# EasyEDA Pro project ProPrj_LogicCard.epro, board PCB1
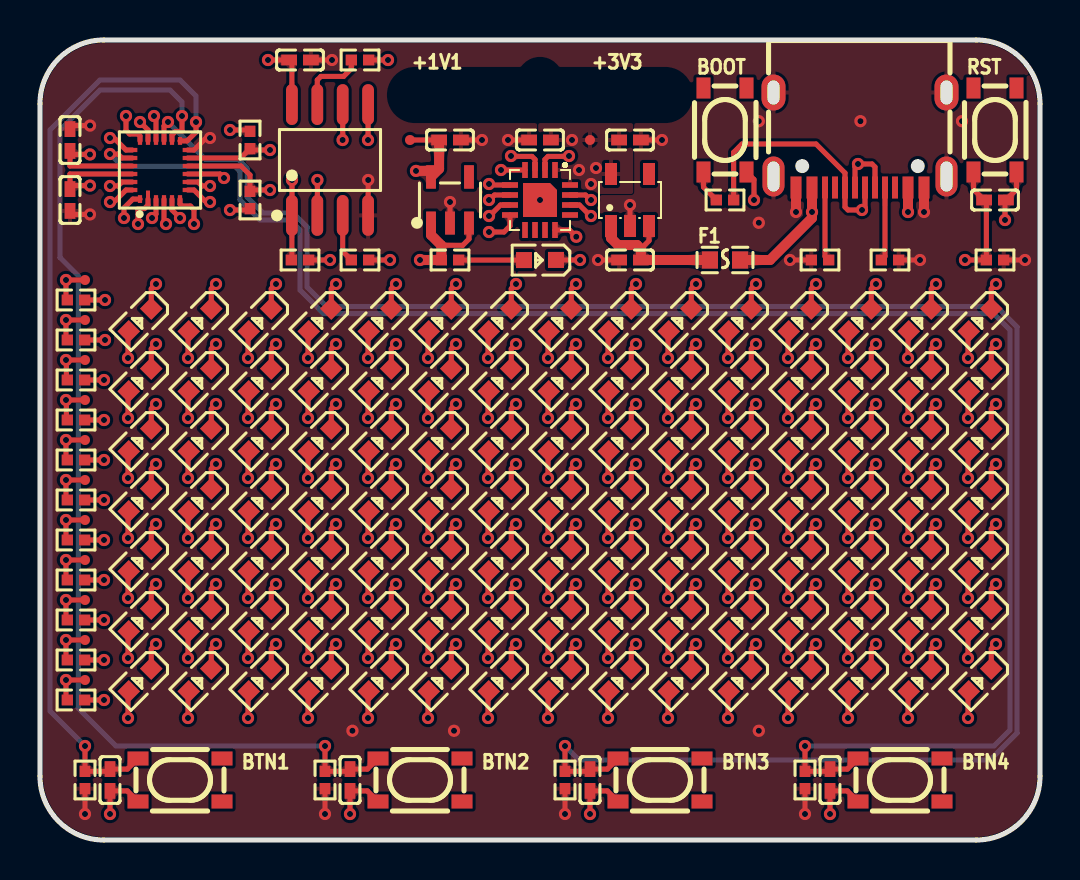
[diagram p1: board, top side]
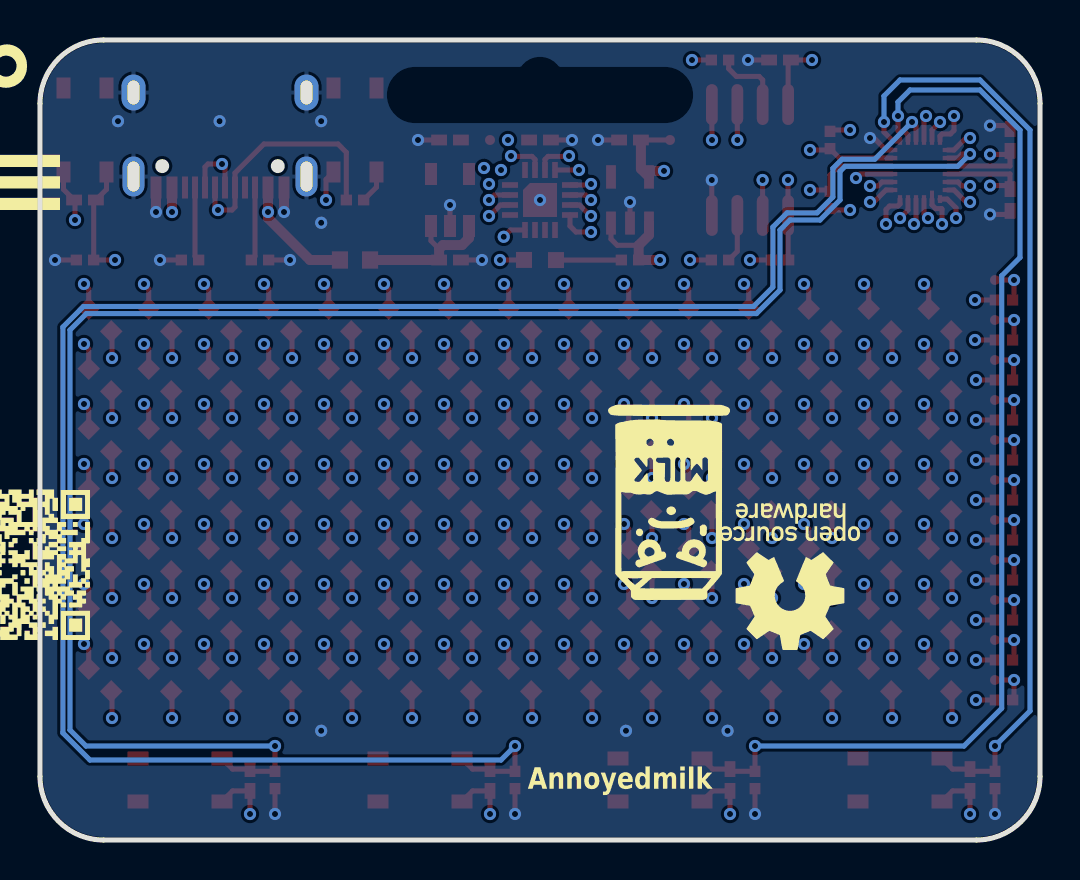
[diagram p2: board, bottom side, seen from below]

Outline 50 x 40 mm; copper layers: Top Layer, Inner1, Inner2, Bottom Layer. Coordinates in mm from the lower left corner of the outline.
Outline path: 0,36.82 0,3.18 arc(0.93,0.93) 3.18,0 46.82,0 arc(49.07,0.93) 50,3.18 50,36.82 arc(49.07,39.07) 46.82,40 3.18,40 arc(0.93,39.07) 0,36.82
Stack: Top Layer 0.035mm Outer layer thickness 1oz / Dielectric1 0.2104mm 7628 RC49% 8.6mil / Inner1 0.0152mm Inner layer thickness / Dielectric2 1.065mm 1.1mm H/HOZ Copper / Inner2 0.0152mm Inner layer thickness / Dielectric3 0.2104mm 7628 RC49% 8.6mil / Bottom Layer 0.035mm Outer layer thickness 1oz

## Design rules (mm)
template: Custom Config
spacing copperThickness1oz (default): track to track 0.102, other pairs 0.152 to 0.3
spacing copperThickness2oz: track to track 0.203, other pairs 0.152 to 0.3
track width copperThickness1oz (default): min 0.127, default 0.254, max 2.54
track width copperThickness2oz: min 0.203, default 0.254, max 2.54
differential pair differentialPair (default): width min 0.127, default 0.254, max 2.54; gap min 0.152, default 0.152
via viaSize (default): diameter min 0.5, default 0.61, max 10; hole min 0.3, default 0.305, max 6.3

## Placement (name value [footprint] x y rotation side)
+1V1  -  [Test-Point-0.5mm]  18.5 35 0 top
+3V3  -  [Test-Point-0.5mm]  27.5 35 0 top
BOOT  SKRPACE010  [KEY-SMD_4P-L4.2-W3.2-P2.20-LS4.6]  34.25 35.5 90 top
BTN1  SKRPACE010  [KEY-SMD_4P-L4.2-W3.2-P2.20-LS4.6]  7 3 0 top
BTN2  SKRPACE010  [KEY-SMD_4P-L4.2-W3.2-P2.20-LS4.6]  19 3 0 top
BTN3  SKRPACE010  [KEY-SMD_4P-L4.2-W3.2-P2.20-LS4.6]  31 3 0 top
BTN4  SKRPACE010  [KEY-SMD_4P-L4.2-W3.2-P2.20-LS4.6]  43 3 0 top
C1  TYPE-C 16PIN 2MD(073)  [USB-C-SMD_TYPE-C-6PIN-2MD-073]  41 35 180 top
C5  1uF  [C0402]  25 35 0 top
C6  1uF  [C0402]  47.75 32 0 top
C8  1uF  [C0402]  29.5 35 180 top
C9  1uF  [C0402]  3.5 3 270 top
C10  1uF  [C0402]  15.5 3 270 top
C11  1uF  [C0402]  27.5 3 270 top
C12  1uF  [C0402]  39.5 3 270 top
C14  1uF  [C0402]  20.5 35 180 top
C15  1uF  [C0402]  1.5 32 270 top
C16  1uF  [C0402]  1.5 35 90 top
C17  1uF  [C0402]  29.5 29 0 top
C18  1uF  [C0402]  13 39 0 top
F1  MF-FSMF035X-2  [F0603]  34.25 29 180 top
LED1  19-213/Y2C-CQ2R2L/3T(CY)  [LED0603-RD-YELLOW]  5 26 225 top
LED2  19-213/Y2C-CQ2R2L/3T(CY)  [LED0603-RD-YELLOW]  8 26 225 top
LED3  19-213/Y2C-CQ2R2L/3T(CY)  [LED0603-RD-YELLOW]  11 26 225 top
LED4  19-213/Y2C-CQ2R2L/3T(CY)  [LED0603-RD-YELLOW]  14 26 225 top
LED5  19-213/Y2C-CQ2R2L/3T(CY)  [LED0603-RD-YELLOW]  17 26 225 top
LED6  19-213/Y2C-CQ2R2L/3T(CY)  [LED0603-RD-YELLOW]  20 26 225 top
LED7  19-213/Y2C-CQ2R2L/3T(CY)  [LED0603-RD-YELLOW]  23 26 225 top
LED8  19-213/Y2C-CQ2R2L/3T(CY)  [LED0603-RD-YELLOW]  26 26 225 top
LED9  19-213/Y2C-CQ2R2L/3T(CY)  [LED0603-RD-YELLOW]  29 26 225 top
LED10  19-213/Y2C-CQ2R2L/3T(CY)  [LED0603-RD-YELLOW]  32 26 225 top
LED11  19-213/Y2C-CQ2R2L/3T(CY)  [LED0603-RD-YELLOW]  35 26 225 top
LED12  19-213/Y2C-CQ2R2L/3T(CY)  [LED0603-RD-YELLOW]  38 26 225 top
LED13  19-213/Y2C-CQ2R2L/3T(CY)  [LED0603-RD-YELLOW]  41 26 225 top
LED14  19-213/Y2C-CQ2R2L/3T(CY)  [LED0603-RD-YELLOW]  44 26 225 top
LED15  19-213/Y2C-CQ2R2L/3T(CY)  [LED0603-RD-YELLOW]  47 26 225 top
LED16  19-213/Y2C-CQ2R2L/3T(CY)  [LED0603-RD-YELLOW]  5 23 225 top
LED17  19-213/Y2C-CQ2R2L/3T(CY)  [LED0603-RD-YELLOW]  8 23 225 top
LED18  19-213/Y2C-CQ2R2L/3T(CY)  [LED0603-RD-YELLOW]  11 23 225 top
LED19  19-213/Y2C-CQ2R2L/3T(CY)  [LED0603-RD-YELLOW]  14 23 225 top
LED20  19-213/Y2C-CQ2R2L/3T(CY)  [LED0603-RD-YELLOW]  17 23 225 top
LED21  19-213/Y2C-CQ2R2L/3T(CY)  [LED0603-RD-YELLOW]  20 23 225 top
LED22  19-213/Y2C-CQ2R2L/3T(CY)  [LED0603-RD-YELLOW]  23 23 225 top
LED23  19-213/Y2C-CQ2R2L/3T(CY)  [LED0603-RD-YELLOW]  26 23 225 top
LED24  19-213/Y2C-CQ2R2L/3T(CY)  [LED0603-RD-YELLOW]  29 23 225 top
LED25  19-213/Y2C-CQ2R2L/3T(CY)  [LED0603-RD-YELLOW]  32 23 225 top
LED26  19-213/Y2C-CQ2R2L/3T(CY)  [LED0603-RD-YELLOW]  35 23 225 top
LED27  19-213/Y2C-CQ2R2L/3T(CY)  [LED0603-RD-YELLOW]  38 23 225 top
LED28  19-213/Y2C-CQ2R2L/3T(CY)  [LED0603-RD-YELLOW]  41 23 225 top
LED29  19-213/Y2C-CQ2R2L/3T(CY)  [LED0603-RD-YELLOW]  44 23 225 top
LED30  19-213/Y2C-CQ2R2L/3T(CY)  [LED0603-RD-YELLOW]  47 23 225 top
LED31  19-213/Y2C-CQ2R2L/3T(CY)  [LED0603-RD-YELLOW]  5 20 225 top
LED32  19-213/Y2C-CQ2R2L/3T(CY)  [LED0603-RD-YELLOW]  8 20 225 top
LED33  19-213/Y2C-CQ2R2L/3T(CY)  [LED0603-RD-YELLOW]  11 20 225 top
LED34  19-213/Y2C-CQ2R2L/3T(CY)  [LED0603-RD-YELLOW]  14 20 225 top
LED35  19-213/Y2C-CQ2R2L/3T(CY)  [LED0603-RD-YELLOW]  17 20 225 top
LED36  19-213/Y2C-CQ2R2L/3T(CY)  [LED0603-RD-YELLOW]  20 20 225 top
LED37  19-213/Y2C-CQ2R2L/3T(CY)  [LED0603-RD-YELLOW]  23 20 225 top
LED38  19-213/Y2C-CQ2R2L/3T(CY)  [LED0603-RD-YELLOW]  26 20 225 top
LED39  19-213/Y2C-CQ2R2L/3T(CY)  [LED0603-RD-YELLOW]  29 20 225 top
LED40  19-213/Y2C-CQ2R2L/3T(CY)  [LED0603-RD-YELLOW]  32 20 225 top
LED41  19-213/Y2C-CQ2R2L/3T(CY)  [LED0603-RD-YELLOW]  35 20 225 top
LED42  19-213/Y2C-CQ2R2L/3T(CY)  [LED0603-RD-YELLOW]  38 20 225 top
LED43  19-213/Y2C-CQ2R2L/3T(CY)  [LED0603-RD-YELLOW]  41 20 225 top
LED44  19-213/Y2C-CQ2R2L/3T(CY)  [LED0603-RD-YELLOW]  44 20 225 top
LED45  19-213/Y2C-CQ2R2L/3T(CY)  [LED0603-RD-YELLOW]  47 20 225 top
LED46  19-213/Y2C-CQ2R2L/3T(CY)  [LED0603-RD-YELLOW]  5 17 225 top
LED47  19-213/Y2C-CQ2R2L/3T(CY)  [LED0603-RD-YELLOW]  8 17 225 top
LED48  19-213/Y2C-CQ2R2L/3T(CY)  [LED0603-RD-YELLOW]  11 17 225 top
LED49  19-213/Y2C-CQ2R2L/3T(CY)  [LED0603-RD-YELLOW]  14 17 225 top
LED50  19-213/Y2C-CQ2R2L/3T(CY)  [LED0603-RD-YELLOW]  17 17 225 top
LED51  19-213/Y2C-CQ2R2L/3T(CY)  [LED0603-RD-YELLOW]  20 17 225 top
LED52  19-213/Y2C-CQ2R2L/3T(CY)  [LED0603-RD-YELLOW]  23 17 225 top
LED53  19-213/Y2C-CQ2R2L/3T(CY)  [LED0603-RD-YELLOW]  26 17 225 top
LED54  19-213/Y2C-CQ2R2L/3T(CY)  [LED0603-RD-YELLOW]  29 17 225 top
LED55  19-213/Y2C-CQ2R2L/3T(CY)  [LED0603-RD-YELLOW]  32 17 225 top
LED56  19-213/Y2C-CQ2R2L/3T(CY)  [LED0603-RD-YELLOW]  35 17 225 top
LED57  19-213/Y2C-CQ2R2L/3T(CY)  [LED0603-RD-YELLOW]  38 17 225 top
LED58  19-213/Y2C-CQ2R2L/3T(CY)  [LED0603-RD-YELLOW]  41 17 225 top
LED59  19-213/Y2C-CQ2R2L/3T(CY)  [LED0603-RD-YELLOW]  44 17 225 top
LED60  19-213/Y2C-CQ2R2L/3T(CY)  [LED0603-RD-YELLOW]  47 17 225 top
LED61  19-213/Y2C-CQ2R2L/3T(CY)  [LED0603-RD-YELLOW]  5 14 225 top
LED62  19-213/Y2C-CQ2R2L/3T(CY)  [LED0603-RD-YELLOW]  8 14 225 top
LED63  19-213/Y2C-CQ2R2L/3T(CY)  [LED0603-RD-YELLOW]  11 14 225 top
LED64  19-213/Y2C-CQ2R2L/3T(CY)  [LED0603-RD-YELLOW]  14 14 225 top
LED65  19-213/Y2C-CQ2R2L/3T(CY)  [LED0603-RD-YELLOW]  17 14 225 top
LED66  19-213/Y2C-CQ2R2L/3T(CY)  [LED0603-RD-YELLOW]  20 14 225 top
LED67  19-213/Y2C-CQ2R2L/3T(CY)  [LED0603-RD-YELLOW]  23 14 225 top
LED68  19-213/Y2C-CQ2R2L/3T(CY)  [LED0603-RD-YELLOW]  26 14 225 top
LED69  19-213/Y2C-CQ2R2L/3T(CY)  [LED0603-RD-YELLOW]  29 14 225 top
LED70  19-213/Y2C-CQ2R2L/3T(CY)  [LED0603-RD-YELLOW]  32 14 225 top
LED71  19-213/Y2C-CQ2R2L/3T(CY)  [LED0603-RD-YELLOW]  35 14 225 top
LED72  19-213/Y2C-CQ2R2L/3T(CY)  [LED0603-RD-YELLOW]  38 14 225 top
LED73  19-213/Y2C-CQ2R2L/3T(CY)  [LED0603-RD-YELLOW]  41 14 225 top
LED74  19-213/Y2C-CQ2R2L/3T(CY)  [LED0603-RD-YELLOW]  44 14 225 top
LED75  19-213/Y2C-CQ2R2L/3T(CY)  [LED0603-RD-YELLOW]  47 14 225 top
LED76  19-213/Y2C-CQ2R2L/3T(CY)  [LED0603-RD-YELLOW]  5 11 225 top
LED77  19-213/Y2C-CQ2R2L/3T(CY)  [LED0603-RD-YELLOW]  8 11 225 top
LED78  19-213/Y2C-CQ2R2L/3T(CY)  [LED0603-RD-YELLOW]  11 11 225 top
LED79  19-213/Y2C-CQ2R2L/3T(CY)  [LED0603-RD-YELLOW]  14 11 225 top
LED80  19-213/Y2C-CQ2R2L/3T(CY)  [LED0603-RD-YELLOW]  17 11 225 top
LED81  19-213/Y2C-CQ2R2L/3T(CY)  [LED0603-RD-YELLOW]  20 11 225 top
LED82  19-213/Y2C-CQ2R2L/3T(CY)  [LED0603-RD-YELLOW]  23 11 225 top
LED83  19-213/Y2C-CQ2R2L/3T(CY)  [LED0603-RD-YELLOW]  26 11 225 top
LED84  19-213/Y2C-CQ2R2L/3T(CY)  [LED0603-RD-YELLOW]  29 11 225 top
LED85  19-213/Y2C-CQ2R2L/3T(CY)  [LED0603-RD-YELLOW]  32 11 225 top
LED86  19-213/Y2C-CQ2R2L/3T(CY)  [LED0603-RD-YELLOW]  35 11 225 top
LED87  19-213/Y2C-CQ2R2L/3T(CY)  [LED0603-RD-YELLOW]  38 11 225 top
LED88  19-213/Y2C-CQ2R2L/3T(CY)  [LED0603-RD-YELLOW]  41 11 225 top
LED89  19-213/Y2C-CQ2R2L/3T(CY)  [LED0603-RD-YELLOW]  44 11 225 top
LED90  19-213/Y2C-CQ2R2L/3T(CY)  [LED0603-RD-YELLOW]  47 11 225 top
LED91  19-213/Y2C-CQ2R2L/3T(CY)  [LED0603-RD-YELLOW]  5 8 225 top
LED92  19-213/Y2C-CQ2R2L/3T(CY)  [LED0603-RD-YELLOW]  8 8 225 top
LED93  19-213/Y2C-CQ2R2L/3T(CY)  [LED0603-RD-YELLOW]  11 8 225 top
LED94  19-213/Y2C-CQ2R2L/3T(CY)  [LED0603-RD-YELLOW]  14 8 225 top
LED95  19-213/Y2C-CQ2R2L/3T(CY)  [LED0603-RD-YELLOW]  17 8 225 top
LED96  19-213/Y2C-CQ2R2L/3T(CY)  [LED0603-RD-YELLOW]  20 8 225 top
LED97  19-213/Y2C-CQ2R2L/3T(CY)  [LED0603-RD-YELLOW]  23 8 225 top
LED98  19-213/Y2C-CQ2R2L/3T(CY)  [LED0603-RD-YELLOW]  26 8 225 top
LED99  19-213/Y2C-CQ2R2L/3T(CY)  [LED0603-RD-YELLOW]  29 8 225 top
LED100  19-213/Y2C-CQ2R2L/3T(CY)  [LED0603-RD-YELLOW]  32 8 225 top
LED101  19-213/Y2C-CQ2R2L/3T(CY)  [LED0603-RD-YELLOW]  35 8 225 top
LED102  19-213/Y2C-CQ2R2L/3T(CY)  [LED0603-RD-YELLOW]  38 8 225 top
LED103  19-213/Y2C-CQ2R2L/3T(CY)  [LED0603-RD-YELLOW]  41 8 225 top
LED104  19-213/Y2C-CQ2R2L/3T(CY)  [LED0603-RD-YELLOW]  44 8 225 top
LED105  19-213/Y2C-CQ2R2L/3T(CY)  [LED0603-RD-YELLOW]  47 8 225 top
LED106  19-213/Y2C-CQ2R2L/3T(CY)  [LED0603-RD-YELLOW]  25 29 180 top
R18  5.1kΩ  [R0402]  39 29 180 top
R19  5.1kΩ  [R0402]  42.5 29 0 top
R23  10kΩ  [R0402]  47.75 29 0 top
R24  10kΩ  [R0402]  34.25 32 0 top
R36  10kΩ  [R0402]  2.25 3 270 top
R37  10kΩ  [R0402]  14.25 3 270 top
R38  10kΩ  [R0402]  26.25 3 270 top
R39  10kΩ  [R0402]  38.25 3 270 top
R41  82Ω  [R0402]  1.8 27 0 top
R42  82Ω  [R0402]  1.8 25 0 top
R43  82Ω  [R0402]  1.8 23 0 top
R44  82Ω  [R0402]  1.8 21 0 top
R45  82Ω  [R0402]  1.8 19 0 top
R46  82Ω  [R0402]  1.8 17 0 top
R47  82Ω  [R0402]  1.8 15 0 top
R48  82Ω  [R0402]  1.8 13 0 top
R49  82Ω  [R0402]  1.8 11 0 top
R50  82Ω  [R0402]  1.8 9 0 top
R51  82Ω  [R0402]  1.8 7 0 top
R52  180Ω  [R0402]  20.5 29 180 top
R53  10kΩ  [R0402]  10.5 32 90 top
R54  10kΩ  [R0402]  10.5 35 270 top
R55  10kΩ  [R0402]  13 29 180 top
R56  10kΩ  [R0402]  16 29 180 top
R57  10kΩ  [R0402]  16 39 180 top
RST  SKRPACE010  [KEY-SMD_4P-L4.2-W3.2-P2.20-LS4.6]  47.75 35.5 90 top
TP1  -  [Test-Point-0.5mm]  2.25 28 0 top
TP2  -  [Test-Point-0.5mm]  2.25 26 0 top
TP3  -  [Test-Point-0.5mm]  2.25 24 0 top
TP4  -  [Test-Point-0.5mm]  2.25 22 0 top
TP5  -  [Test-Point-0.5mm]  2.25 20 0 top
TP6  -  [Test-Point-0.5mm]  2.25 18 0 top
TP7  -  [Test-Point-0.5mm]  2.25 16 0 top
TP8  -  [Test-Point-0.5mm]  2.25 14 0 top
TP9  -  [Test-Point-0.5mm]  2.25 12 0 top
TP10  -  [Test-Point-0.5mm]  2.25 10 0 top
TP11  -  [Test-Point-0.5mm]  2.25 8 0 top
U1  SLG47910V  [STQFN-24_L3.0-W3.0-P0.4_SLG47910V]  6 33.5 90 top
U2  CH552P  [VQFN-16_L3.0-W3.0-P0.50-BL-EP1.7]  25 32 180 top
U3  W25Q80DVSNIG  [SOIC-8_L4.9-W3.9-P1.27-LS6.0-BL]  14.5 34 0 top
U4  TLV70233DBVR  [SOT-23-5_L3.0-W1.7-P0.95-LS2.8-BR]  29.5 32 270 top
U5  TLV74311PDBVR  [SOT-23-5_L3.0-W1.7-P0.95-LS2.8-BL]  20.5 32 0 top

## Footprints (pads in the part's own frame, mm; a bottom-side part is the same pattern mirrored in y, then rotated)
C0402
  rect 0.79x0.54 smd: 1(-0.545,0) 2(0.545,0)
F0603
  rect 0.806x0.864 smd: 1(-0.753,0) 2(0.753,0)
KEY-SMD_4P-L4.2-W3.2-P2.20-LS4.6
  rect 1.05x0.7 smd: 1(-2.1,1.075) 2(2.1,1.075) 3(-2.1,-1.075) 4(2.1,-1.075)
LED0603-RD-YELLOW
  rect 0.8x0.8 smd: 1(-0.799,-0.004) 2(0.799,0.004)
R0402
  rect 0.566x0.54 smd: 1(-0.433,0) 2(0.433,0)
SOIC-8_L4.9-W3.9-P1.27-LS6.0-BL
  oval 0.588x2.045 smd: 1(-1.905,-2.772) 2(-0.635,-2.772) 3(0.635,-2.772) 4(1.905,-2.772) 5(1.905,2.772) 6(0.635,2.772) 7(-0.635,2.772) 8(-1.905,2.772)
SOT-23-5_L3.0-W1.7-P0.95-LS2.8-BL
  rect 0.49x1.157 smd: 1(-0.95,-1.153) 2(0,-1.153) 3(0.95,-1.153)
  rect 0.49x1.175 smd: 4(0.95,1.153) 5(-0.95,1.153)
SOT-23-5_L3.0-W1.7-P0.95-LS2.8-BR
  rect 1.1x0.6 smd: 1(1.3,-0.95) 2(1.3,0) 3(1.3,0.95) 4(-1.3,0.95) 5(-1.3,-0.95)
STQFN-24_L3.0-W3.0-P0.4_SLG47910V
  rect 0.39x0.21 smd: 1(-1.455,1) 3(-1.455,0.2) 4(-1.455,-0.2) 5(-1.455,-0.6) 6(-1.455,-1) 13(1.455,-1) 14(1.455,-0.6) 15(1.455,-0.2) 16(1.455,0.2) 17(1.455,0.6) 18(1.455,1)
  rect 0.605x0.2 smd: 2(-1.33,0.6)
  rect 0.21x0.515 smd: 7(-1,-1.393) 8(-0.6,-1.393) 9(-0.2,-1.393) 10(0.2,-1.393) 11(0.6,-1.393) 12(1,-1.393) 19(1,1.393) 20(0.6,1.393) 21(0.2,1.393) 22(-0.2,1.393) 23(-0.6,1.393) 24(-1,1.393)
Test-Point-0.5mm
  round 0.5 smd: 1(0,0)
USB-C-SMD_TYPE-C-6PIN-2MD-073
  rect 0.55x1.1 smd: 1(-3.2,2.375) 2(-2.4,2.375) 11(2.4,2.375) 12(3.2,2.375)
  rect 0.3x1.1 smd: 3(-1.75,2.375) 4(-1.25,2.375) 5(-0.75,2.375) 6(-0.25,2.375) 7(0.25,2.375) 8(0.75,2.375) 9(1.25,2.375) 10(1.75,2.375)
  oval 1.1x2 hole 0.6x1.5: 13(-4.325,1.825) 14(4.325,1.825)
  oval 1.2x1.8 hole 0.6x1.2: 13(-4.325,-2.375) 14(4.325,-2.375)
VQFN-16_L3.0-W3.0-P0.50-BL-EP1.7
  rect 0.28x0.8 smd: 1(-0.749,-1.5) 2(-0.249,-1.5) 3(0.249,-1.5) 4(0.75,-1.5) 9(0.75,1.5) 10(0.249,1.5) 11(-0.249,1.5) 12(-0.749,1.5)
  rect 0.8x0.28 smd: 5(1.5,-0.749) 6(1.5,-0.249) 7(1.5,0.249) 8(1.5,0.75) 13(-1.5,0.75) 14(-1.5,0.249) 15(-1.5,-0.249) 16(-1.5,-0.749)
  custom 1.7x1.7 smd: 17(0,0)

## Nets
As in the schematic.

Pads without a net: BOOT 2 4; BTN1 2 4; BTN2 2 4; BTN3 2 4; BTN4 2 4; C1 3 9; RST 2 4; U2 9 10 11 13; U4 4; U5 4

## Via types
v1: diameter 0.61, hole 0.305, Top Layer to Bottom Layer, 325 vias

## Routing (per net, layer and track width the routed paths; a pad name or vN(x,y) marks a point on that pad's centre or on a via; arc(x,y) is an arc through that point)
+1V1: length 34.6
  Top Layer w0.254: 1.68,32.72 1.5,32.9 1.5,33.3 U1.22 ; 1.68,32.72 v1(2.5,32.72) ; 1.68,32.72 C15.1 ; C14.2 +1V1.1
  Top Layer w0.5: C14.2 19.96,33.56 U5.5 19.55,33.45 v1(18.8,33.45)
  Inner2 w0.5: v1(18.8,33.45) 18.8,33.93 14.79,37.94 1.94,37.94 1,37 1,34.22 v1(2.5,32.72)
+3V3: length 206.3
  Top Layer w0.254: v1(35.7,32) 35.7,33.03 BOOT.3 ; v1(9.5,35.5) 10.43,35.5 R54.1 ; v1(48.25,31) 48.25,31.95 C6.2 48.82,32.53 RST.3 ; v1(11.4,39) 12.57,39 12.59,38.97 U3.8 ; R53.1 10.43,31.5 v1(9.5,31.5) ; v1(39.5,1.3) C12.2 40.37,2.45 BTN4.3 ; v1(27.5,1.3) C11.2 28.37,2.45 BTN3.3 ; v1(17.5,29) R56.1 ; v1(14.5,29) R55.1 ; BTN1.3 4.37,2.45 C9.2 v1(3.5,1.3) ; BTN2.3 16.37,2.45 C10.2 v1(15.5,1.3) ; 1.68,34.28 1.5,34.1 1.5,33.7 U1.21 ; 1.68,34.28 v1(2.5,34.28) ; 1.68,34.28 C16.1 ; U5.3 21.45,30.05 21.13,29.73 20.07,29.73 ; v1(17.4,39) R57.1
  Top Layer w0.5: v1(19,29) R52.2 20.07,29.73 19.55,30.25 U5.1
  Inner1 w0.254: v1(35.7,32) 33.8,30.1 27.82,30.1 26.9,31.02 26.9,32.6 27.1,32.8 v1(27.55,32.8) ; v1(19,29) v1(17.5,29) v1(14.5,29) 12,29 v1(9.5,31.5)
  Inner2 w0.254: v1(27.8,33.6) 29.07,32.33 29.74,32.33 30.08,32 v1(35.7,32) 36.23,32 37.48,30.75 44.37,30.75 44.63,31 v1(48.25,31) 48.25,28.75 49,28 49,3.5 46.8,1.3 v1(39.5,1.3) 39.08,1.3 38.49,1.88 38.01,1.88 37.42,1.3 v1(27.5,1.3) 27.14,1.3 26.46,1.98 26.1,1.98 25.42,1.3 v1(15.5,1.3) 15.2,1.3 14.5,2 14,2 13.3,1.3 v1(3.5,1.3) ; v1(11.4,39) 13.77,39 14.36,38.42 14.84,38.42 15.43,39 v1(17.4,39) 17.4,38.1 17,37.7 17,36.5 17.92,35.58 19.5,35.58 ; 10.92,35.5 v1(9.5,35.5) 8,37 2.95,37 1.82,35.87 1.82,34.96 v1(2.5,34.28) ; 10.92,35.5 13.8,35.5 14.89,34.42 17.01,34.42 18.56,32.87 19.04,32.87 19.5,33.33 19.5,35.58 ; 10.92,35.5 10.92,32.08 14,29 v1(14.5,29) ; 19.5,35.58 26.02,35.58 v1(26.6,35)
  vias: v1(26.95,33.5)
GND: length 23.8
  Top Layer w0.254: 8.5,35.05 8.25,35.05 7.7,34.5 U1.12 ; R36.2 v1(2.25,1.3) ; v1(14.6,39) C18.2 ; C16.2 1.68,35.72 v1(2.5,35.72) ; R39.2 v1(38.25,1.3) ; v1(23.4,35) 24.57,35 ; v1(27.9,29) 29.07,29 ; R37.2 v1(14.25,1.3) ; v1(49.25,29) R23.2 ; v1(20.5,31.9) U5.2 ; C15.2 1.68,31.28 v1(2.5,31.28) ; v1(22.1,35) 20.93,35 ; U3.4 16.41,31.23 v1(16.41,33) ; v1(37.5,29) R18.2 ; v1(44,29) R19.2 ; R38.2 v1(26.25,1.3) ; v1(29.5,31.75) U4.2 ; v1(31.1,35) 29.93,35
  Top Layer w0.5: v1(44.2,31.4) C1.1 ; v1(37.8,31.4) C1.12
  vias: v1(8.5,35.1) v1(15.62,5.46) v1(20.7,5.46) v1(25,32) v1(35.94,35.94) v1(35.94,30.86) v1(35.94,5.46) v1(41.02,35.94) v1(46.1,35.94)
VBUS: length 13.8
  Top Layer w0.5: F1.1 36.5,29 38.6,31.1 C1.11 v1(38.6,31.4) ; v1(43.4,31.4) C1.2
  Inner1 w0.5: v1(43.4,31.4) 42.7,30.7 39.3,30.7 v1(38.6,31.4)
VIN: length 7.6
  Top Layer w0.254: 30.04,29.56 30.45,29.96 U4.3
  Top Layer w0.5: U4.1 28.55,30.7 28.55,30.1 28.9,29.75 29.85,29.75 30.04,29.56 C17.2 F1.2
BUTTON_1: length 47.2
  Top Layer w0.254: BTN1.1 4.37,3.55 C9.1 3.39,3.43 R36.1 v1(2.25,4.7) ; U1.13 7.36,34.95 7.8,35.4 v1(7.8,35.9)
  Bottom Layer w0.254: v1(2.25,4.7) 0.5,6.45 0.5,35.5 3,38 7,38 7.8,37.2 v1(7.8,35.9)
BUTTON_2: length 56.1
  Top Layer w0.254: U1.14 6.6,35.25 6.78,35.43 7.07,35.43 7.1,35.45 v1(7.1,36.2) ; BTN2.1 16.37,3.55 C10.1 15.39,3.43 R37.1 v1(14.25,4.7)
  Bottom Layer w0.254: v1(7.1,36.2) 7.1,36.9 6.5,37.5 3,37.5 1,35.5 1,29.13 1.91,28.21 1.91,6.59 3.8,4.7 v1(14.25,4.7)
BUTTON_3: length 98.3
  Top Layer w0.254: U1.15 6.2,35.7 v1(6.4,35.9) ; v1(26.25,4.7) R38.1 27.39,3.43 C11.1 28.37,3.55 BTN3.1
  Bottom Layer w0.254: v1(6.4,35.9) 8.26,34.04 9.89,34.04 10.36,33.58 10.36,32.15 11.15,31.36 12.65,31.36 13.36,30.65 13.36,27.64 14.32,26.68 47.83,26.68 48.86,25.65 48.86,5.35 47.5,4 26.95,4 v1(26.25,4.7)
BUTTON_4: length 87.2
  Top Layer w0.254: U1.20 4.1,34.1 3.91,34.29 3.49,34.29 ; BTN4.1 40.37,3.55 C12.1 39.39,3.43 R39.1 v1(38.25,4.7)
  Bottom Layer w0.254: v1(38.25,4.7) 47.7,4.7 48.5,5.5 48.5,25.5 47.68,26.32 14.18,26.32 13,27.5 13,30.5 12.5,31 11,31 10,32 10,33.43 9.75,33.68 4.12,33.68 v1(3.5,34.3)
CATH_0: length 141.1
  Top Layer w0.254: 26.56,26.57 26.56,27.56 26.8,27.8 ; 4.44,7.43 4.4,7.4 4.4,6.1 ; 19.4,15.1 19.4,16.4 19.44,16.43 ; 29.56,26.57 29.56,27.56 29.8,27.8 ; 34.44,19.43 34.4,19.4 34.4,18.1 ; 34.4,24.1 34.4,25.4 34.44,25.43 ; 4.44,19.43 4.4,19.4 4.4,18.1 ; 23.8,27.8 23.56,27.56 23.56,26.57 ; 17.56,26.57 17.56,27.56 17.8,27.8 ; 20.56,26.57 20.56,27.56 20.8,27.8 ; 32.8,27.8 32.56,27.56 32.56,26.57 ; 4.44,13.43 4.4,13.4 4.4,12.1 ; 14.8,27.8 14.56,27.56 14.56,26.57 ; 11.8,27.8 11.56,27.56 11.56,26.57 ; R41.2 3.24,27 ; 5.56,26.57 5.56,27.56 5.8,27.8 ; 34.44,13.43 34.4,13.4 34.4,12.1 ; v1(8.8,27.8) 8.56,27.56 LED2.1 ; 19.44,22.43 19.4,22.4 19.4,21.1 ; 34.4,6.1 34.4,7.4 34.44,7.43 ; 19.4,9.1 19.4,10.4 19.44,10.43
  Inner1 w0.254: v1(32.8,27.8) v1(29.8,27.8) v1(26.8,27.8) v1(23.8,27.8) v1(20.8,27.8) v1(17.8,27.8) v1(14.8,27.8) v1(11.8,27.8) v1(8.8,27.8) v1(5.8,27.8) ; v1(19.4,9.1) 17.4,9.1 16.5,10 16,10 14,8 6.3,8 v1(4.4,6.1) ; v1(34.4,24.1) 33.3,23 20.5,23 19.4,21.9 v1(19.4,21.1)
  Inner2 w0.254: v1(19.4,21.1) 19.98,20.52 19.98,17.86 19.4,17.27 v1(19.4,15.1) 19.4,12.93 18.82,12.34 18.82,11.86 19.4,11.27 v1(19.4,9.1) ; v1(4.4,18.1) 4.4,15.93 3.82,15.34 3.82,14.86 4.4,14.27 v1(4.4,12.1) 4.4,9.93 3.82,9.34 3.82,8.86 4.4,8.27 v1(4.4,6.1) ; v1(34.4,6.1) 34.4,8.27 34.98,8.86 34.98,9.34 34.4,9.93 v1(34.4,12.1) 34.4,14.27 33.82,14.86 33.82,15.34 34.4,15.93 v1(34.4,18.1) 34.4,20.27 33.82,20.86 33.82,21.34 34.4,21.93 v1(34.4,24.1) 34.4,26.2 v1(32.8,27.8) ; v1(5.8,27.8) 4.05,27.8 v1(3.25,27)
CATH_1: length 145.4
  Top Layer w0.254: LED17.1 8.56,24.56 v1(8.8,24.8) ; 38.56,26.57 38.56,27.56 38.8,27.8 ; 5.56,23.57 5.56,24.56 5.8,24.8 ; 22.4,15.1 22.4,16.4 22.44,16.43 ; v1(7.4,12.1) 7.4,13.39 7.44,13.43 ; 22.4,9.1 22.4,10.4 22.44,10.43 ; 4.44,25.43 4.4,25.4 4.4,24.1 ; 35.56,26.57 35.56,27.56 35.8,27.8 ; 37.4,18.1 37.4,19.4 37.44,19.43 ; 44.8,27.8 44.56,27.56 44.56,26.57 ; 37.4,6.1 37.4,7.4 37.44,7.43 ; 37.44,13.43 37.4,13.4 37.4,12.1 ; 11.8,24.8 11.56,24.56 11.56,23.57 ; 17.56,23.57 17.56,24.56 17.8,24.8 ; 7.44,19.43 7.4,19.39 v1(7.4,18.1) ; 41.8,27.8 41.56,27.56 41.56,26.57 ; 14.56,23.57 14.56,24.56 14.8,24.8 ; 47.56,26.57 47.56,27.56 47.8,27.8 ; v1(7.4,6.1) 7.4,7.39 7.44,7.43 ; R42.2 3.24,25 ; 22.44,22.43 22.4,22.4 22.4,21.1
  Inner1 w0.254: v1(47.8,27.8) v1(44.8,27.8) v1(41.8,27.8) v1(38.8,27.8) v1(35.8,27.8) 33.38,25.38 18.38,25.38 v1(17.8,24.8) v1(14.8,24.8) v1(11.8,24.8) 10.6,26 10,26 v1(8.8,24.8)
  Inner2 w0.254: v1(17.8,24.8) 18.5,25.5 20.93,25.5 21.68,24.75 21.68,21.82 v1(22.4,21.1) 21.82,20.52 21.82,15.68 v1(22.4,15.1) 21.82,14.52 21.82,11.86 22.4,11.27 v1(22.4,9.1) ; v1(8.8,24.8) 7.98,23.98 7.98,22.51 6.82,21.34 6.82,19.01 7.4,18.42 v1(7.4,18.1) 7.4,15.93 6.82,15.34 6.82,14.86 7.4,14.27 v1(7.4,12.1) 7.4,9.93 6.82,9.34 6.82,8.86 7.4,8.27 v1(7.4,6.1) ; v1(4.4,24.1) 4.4,25 ; 4.4,25 v1(3.25,25) ; 4.4,25 5.6,25 v1(5.8,24.8) 7,26 10.6,26 v1(11.8,24.8) ; v1(38.8,27.8) 36.82,25.82 36.82,18.68 v1(37.4,18.1) 36.82,17.52 36.82,14.86 37.4,14.27 v1(37.4,12.1) 38,11.5 38,6.7 v1(37.4,6.1)
CATH_2: length 136.5
  Top Layer w0.254: 40.44,7.43 40.4,7.4 40.4,6.1 ; 40.4,12.1 40.4,13.4 40.44,13.43 ; 38.56,23.57 38.56,24.56 38.8,24.8 ; 47.56,23.57 47.56,24.56 47.8,24.8 ; 40.4,18.1 40.4,19.4 40.44,19.43 ; 29.56,23.57 29.56,24.56 29.8,24.8 ; 26.8,24.8 26.56,24.56 26.56,23.57 ; 10.44,19.43 10.4,19.4 10.4,18.1 ; 44.8,24.8 44.56,24.56 44.56,23.57 ; 20.8,24.8 20.56,24.56 20.56,23.57 ; 35.8,24.8 35.56,24.56 35.56,23.57 ; 10.4,12.1 10.4,13.4 10.44,13.43 ; 32.56,23.57 32.56,24.56 32.8,24.8 ; 25.4,15.1 25.4,16.4 25.44,16.43 ; 41.8,24.8 41.56,24.56 41.56,23.57 ; 2.18,23 3.19,23 ; 23.8,24.8 23.56,24.56 23.56,23.57 ; 10.44,7.43 10.4,7.4 10.4,6.1 ; 7.44,25.43 7.4,25.39 v1(7.4,24.1) ; 37.44,25.43 37.4,25.4 37.4,24.1 ; 25.4,9.1 25.4,10.4 25.44,10.43
  Inner1 w0.254: 37.4,24.8 v1(38.8,24.8) v1(41.8,24.8) v1(44.8,24.8) v1(47.8,24.8) ; 37.4,24.8 v1(35.8,24.8) v1(32.8,24.8) v1(29.8,24.8) v1(26.8,24.8) v1(23.8,24.8) v1(20.8,24.8) 18.8,24.8 18,24 17.13,24 16.64,23.52 13.16,23.52 12.67,24 11.33,24 10.64,24.68 10.16,24.68 9.57,24.1 v1(7.4,24.1) ; 37.4,24.8 v1(37.4,24.1)
  Inner2 w0.254: v1(25.4,9.1) 25.4,11.27 24.82,11.86 24.82,14.52 v1(25.4,15.1) 24.46,16.04 24.46,24.14 v1(23.8,24.8) ; v1(38.8,24.8) 40.4,23.2 40.4,21.93 39.82,21.34 39.82,18.68 v1(40.4,18.1) 39.82,17.52 39.82,14.86 40.4,14.27 v1(40.4,12.1) 39.82,11.52 39.82,6.68 v1(40.4,6.1) ; v1(10.4,6.1) 10.4,8.27 10.98,8.86 10.98,11.19 10.4,11.78 v1(10.4,12.1) 10.98,12.68 10.98,15.34 10.4,15.93 v1(10.4,18.1) 10.98,18.68 10.98,21.52 9.5,23 9.5,25 9.12,25.38 7.88,25.38 7.4,24.9 v1(7.4,24.1) 6.3,23 v1(3.2,23)
CATH_3: length 128.7
  Top Layer w0.254: 17.56,20.57 17.56,21.56 17.8,21.8 ; 43.4,6.1 43.4,7.4 43.44,7.43 ; 2.18,21 3.19,21 ; 28.4,15.1 28.4,16.4 28.44,16.43 ; 28.4,9.1 28.4,10.4 28.44,10.43 ; 25.44,22.43 25.4,22.4 25.4,21.1 ; 5.56,20.57 5.56,21.56 5.8,21.8 ; 13.44,13.43 13.4,13.4 13.4,12.1 ; 14.56,20.57 14.56,21.56 14.8,21.8 ; 10.44,25.43 10.4,25.4 10.4,24.1 ; 23.56,20.57 23.56,21.56 23.8,21.8 ; 11.8,21.8 11.56,21.56 11.56,20.57 ; 40.44,25.43 40.4,25.4 40.4,24.1 ; 32.8,21.8 32.56,21.56 32.56,20.57 ; 13.4,6.1 13.4,7.4 13.44,7.43 ; 43.44,13.43 43.4,13.4 43.4,12.1 ; 26.56,20.57 26.56,21.56 26.8,21.8 ; v1(8.8,21.8) 8.56,21.56 LED32.1 ; 43.44,19.43 43.4,19.4 43.4,18.1 ; 20.8,21.8 20.56,21.56 20.56,20.57 ; 29.8,21.8 29.56,21.56 29.56,20.57
  Inner1 w0.254: v1(14.8,21.8) v1(11.8,21.8) 10.4,21.8 ; v1(25.4,21.1) 25.4,21.8 ; 25.4,21.8 v1(23.8,21.8) v1(20.8,21.8) 20.8,21.3 20,20.5 19,20.5 17.8,21.7 v1(17.8,21.8) ; 25.4,21.8 v1(26.8,21.8) v1(29.8,21.8) 30.5,22.5 32.1,22.5 v1(32.8,21.8) 33.5,22.5 38.8,22.5 v1(40.4,24.1) ; 10.4,21.8 v1(10.4,24.1) ; 10.4,21.8 v1(8.8,21.8) v1(5.8,21.8)
  Inner2 w0.254: v1(29.8,21.8) 29.68,21.68 28.16,21.68 27.82,21.34 27.82,20.86 28.4,20.27 28.4,18.93 28.98,18.34 28.98,17.86 28.4,17.27 v1(28.4,15.1) 28.98,14.52 28.98,11.86 28.4,11.27 v1(28.4,9.1) ; v1(3.2,21) 3.47,21 4.27,21.8 v1(5.8,21.8) ; v1(13.4,6.1) 13.4,8.27 13.98,8.86 13.98,11.52 v1(13.4,12.1) 14,12.7 14,17.17 15.38,18.56 15.38,19.04 14.8,19.63 v1(14.8,21.8) 15.82,22.82 15.82,24.34 16.16,24.68 16.75,24.68 17,24.43 17,22.6 v1(17.8,21.8) ; v1(40.4,24.1) 42.82,21.68 42.82,18.68 v1(43.4,18.1) 42.82,17.52 42.82,14.86 43.4,14.27 v1(43.4,12.1) 42.82,11.52 42.82,8.86 43.4,8.27 v1(43.4,6.1)
CATH_4: length 128.8
  Top Layer w0.254: 16.4,6.1 16.4,7.4 16.44,7.43 ; 47.8,21.8 47.56,21.56 47.56,20.57 ; 14.8,18.8 14.56,18.56 14.56,17.57 ; 46.4,6.1 46.4,7.4 46.44,7.43 ; 17.8,18.8 17.56,18.56 17.56,17.57 ; 13.44,25.43 13.4,25.4 13.4,24.1 ; 11.56,17.57 11.56,18.56 11.8,18.8 ; 28.44,22.43 28.4,22.4 28.4,21.1 ; 38.8,21.8 38.56,21.56 38.56,20.57 ; 46.4,12.1 46.4,13.4 46.44,13.43 ; 13.44,19.43 13.4,19.4 13.4,18.1 ; 5.8,18.8 5.56,18.56 5.56,17.57 ; 41.8,21.8 41.56,21.56 41.56,20.57 ; 31.44,16.43 31.4,16.4 31.4,15.1 ; 2.18,19 3.19,19 ; 31.4,9.1 31.4,10.4 31.44,10.43 ; 43.4,24.1 43.4,25.4 43.44,25.43 ; 44.8,21.8 44.56,21.56 44.56,20.57 ; 35.8,21.8 35.56,21.56 35.56,20.57 ; 16.4,12.1 16.4,13.4 16.44,13.43 ; LED47.1 8.56,18.56 v1(8.8,18.8)
  Inner1 w0.254: 43.4,21.8 v1(44.8,21.8) v1(47.8,21.8) ; 43.4,21.8 v1(43.4,24.1) ; 43.4,21.8 v1(41.8,21.8) v1(38.8,21.8) v1(35.8,21.8) 33.63,21.8 32.94,21.11 32.58,21.11 32.01,21.68 30.51,21.68 29.93,21.1 v1(28.4,21.1) 26.68,19.38 19.08,19.38 18.5,18.8 v1(17.8,18.8) v1(14.8,18.8) 13.4,18.8 ; v1(13.4,18.1) 13.4,18.8 ; 13.4,18.8 v1(11.8,18.8) v1(8.8,18.8) v1(5.8,18.8)
  Inner2 w0.254: v1(28.4,21.1) 28.4,21.03 30.38,19.04 30.38,16.12 v1(31.4,15.1) 30.82,14.52 30.82,9.68 v1(31.4,9.1) ; v1(13.4,24.1) 13.4,21.93 12.82,21.34 12.82,20.86 13.4,20.27 v1(13.4,18.1) ; v1(3.2,19) 3.7,19.5 5.1,19.5 v1(5.8,18.8) ; v1(47.8,21.8) 47.8,19.63 48.38,19.04 48.38,17.21 47.22,16.04 47.22,12.92 v1(46.4,12.1) 46.98,11.52 46.98,8.86 46.4,8.27 v1(46.4,6.1) ; v1(16.4,6.1) 16.4,8.27 16.98,8.86 16.98,11.52 v1(16.4,12.1) 17,12.7 17,18 v1(17.8,18.8)
CATH_5: length 124.5
  Top Layer w0.254: 23.56,17.57 23.56,18.56 23.8,18.8 ; 46.4,24.1 46.4,25.4 46.44,25.43 ; 46.4,18.1 46.4,19.4 46.44,19.43 ; 34.44,10.43 34.4,10.4 34.4,9.1 ; 29.8,18.8 29.56,18.56 29.56,17.57 ; 20.8,18.8 20.56,18.56 20.56,17.57 ; 35.56,17.57 35.56,18.56 35.8,18.8 ; 31.4,21.1 31.4,22.4 31.44,22.43 ; 47.8,18.8 47.56,18.56 47.56,17.57 ; 16.4,24.1 16.4,25.4 16.44,25.43 ; 26.8,18.8 26.56,18.56 26.56,17.57 ; 2.18,17 3.19,17 ; 19.4,6.1 19.4,7.4 19.44,7.43 ; 38.56,17.57 38.56,18.56 38.8,18.8 ; 4.44,10.43 4.4,10.4 4.4,9.1 ; 44.56,17.57 44.56,18.56 44.8,18.8 ; 32.56,17.57 32.56,18.56 32.8,18.8 ; 19.4,12.1 19.4,13.4 19.44,13.43 ; 16.4,18.1 16.4,19.4 16.44,19.43 ; 41.8,18.8 41.56,18.56 41.56,17.57
  Inner1 w0.254: v1(3.2,17) 3.72,17.52 13.64,17.52 14.23,18.1 v1(16.4,18.1) 18.3,18.1 19,18.8 v1(20.8,18.8) v1(23.8,18.8) v1(26.8,18.8) v1(29.8,18.8) 31.4,18.8 ; 31.4,18.8 v1(31.4,21.1) ; 31.4,18.8 v1(32.8,18.8) v1(35.8,18.8) v1(38.8,18.8) v1(41.8,18.8) v1(44.8,18.8) 45.7,18.8 v1(46.4,18.1) 47.1,18.8 v1(47.8,18.8)
  Inner2 w0.254: v1(32.8,18.8) 33.46,18.14 33.46,10.04 v1(34.4,9.1) ; v1(16.4,18.1) 16.4,20.27 16.98,20.86 16.98,21.34 16.4,21.93 v1(16.4,24.1) ; v1(46.4,18.1) 46.4,20.27 45.82,20.86 45.82,21.34 46.4,21.93 v1(46.4,24.1) ; v1(3.2,17) 3.2,17.81 4.07,18.68 4.82,18.68 5,18.5 5,9.7 v1(4.4,9.1) ; v1(19.4,6.1) 19.4,8.27 19.98,8.86 19.98,11.52 v1(19.4,12.1) 20,12.7 20,15.83 20.8,16.63 v1(20.8,18.8)
CATH_6: length 105.8
  Top Layer w0.254: LED62.1 8.56,15.56 v1(8.8,15.8) ; 20.56,14.57 20.56,15.56 20.8,15.8 ; 34.4,21.1 34.4,22.4 34.44,22.43 ; 4.44,16.43 4.4,16.4 4.4,15.1 ; 7.44,10.43 7.4,10.39 v1(7.4,9.1) ; 19.44,25.43 19.4,25.4 19.4,24.1 ; 37.44,10.43 37.4,10.4 37.4,9.1 ; 32.56,14.57 32.56,15.56 32.8,15.8 ; 11.8,15.8 11.56,15.56 11.56,14.57 ; 26.56,14.57 26.56,15.56 26.8,15.8 ; 4.4,21.1 4.4,22.4 4.44,22.43 ; 23.8,15.8 23.56,15.56 23.56,14.57 ; 17.56,14.57 17.56,15.56 17.8,15.8 ; 34.44,16.43 34.4,16.4 34.4,15.1 ; 19.44,19.43 19.4,19.4 19.4,18.1 ; 2.18,15 3.19,15 ; 22.44,7.43 22.4,7.4 22.4,6.1 ; 14.56,14.57 14.56,15.56 14.8,15.8 ; 5.8,15.8 5.56,15.56 5.56,14.57 ; 29.56,14.57 29.56,15.56 29.8,15.8
  Inner1 w0.254: 19.4,15.8 v1(17.8,15.8) v1(14.8,15.8) v1(11.8,15.8) v1(8.8,15.8) v1(5.8,15.8) 5.1,15.8 v1(4.4,15.1) 4.3,15 v1(3.2,15) ; 19.4,15.8 v1(20.8,15.8) v1(23.8,15.8) v1(26.8,15.8) v1(29.8,15.8) v1(32.8,15.8) 33.7,15.8 v1(34.4,15.1) ; 19.4,15.8 v1(19.4,18.1)
  Inner2 w0.254: v1(34.4,21.1) 34.98,20.52 34.98,15.68 v1(34.4,15.1) 36.82,12.68 36.82,11.86 37.4,11.27 v1(37.4,9.1) ; v1(4.4,21.1) 6.38,19.12 6.38,18.56 5.8,17.97 v1(5.8,15.8) ; v1(7.4,9.1) 8.22,9.92 8.22,15.22 v1(8.8,15.8) ; v1(23.8,15.8) 23.8,14.8 23.22,14.22 23.22,12.56 24.5,11.27 24.5,8.2 v1(22.4,6.1) ; v1(19.4,18.1) 19.4,20.27 18.82,20.86 18.82,21.34 19.4,21.93 v1(19.4,24.1)
CATH_7: length 126
  Top Layer w0.254: 5.56,11.57 5.56,12.56 5.8,12.8 ; 22.44,13.43 22.4,13.4 22.4,12.1 ; 11.56,11.57 11.56,12.56 11.8,12.8 ; 22.44,19.43 22.4,19.4 22.4,18.1 ; 22.4,24.1 22.4,25.4 22.44,25.43 ; 41.56,14.57 41.56,15.56 41.8,15.8 ; 14.56,11.57 14.56,12.56 14.8,12.8 ; 2.18,13 3.19,13 ; 25.44,7.43 25.4,7.4 25.4,6.1 ; 37.44,16.43 37.4,16.4 37.4,15.1 ; v1(7.4,15.1) 7.4,16.39 7.44,16.43 ; 40.44,10.43 40.4,10.4 40.4,9.1 ; 7.44,22.43 7.4,22.39 v1(7.4,21.1) ; 47.56,14.57 47.56,15.56 47.8,15.8 ; 44.56,14.57 44.56,15.56 44.8,15.8 ; 37.44,22.43 37.4,22.4 37.4,21.1 ; LED77.1 8.56,12.56 v1(8.8,12.8) ; 38.56,14.57 38.56,15.56 38.8,15.8 ; 35.8,15.8 35.56,15.56 35.56,14.57 ; 17.8,12.8 17.56,12.56 17.56,11.57
  Inner1 w0.254: v1(37.4,15.1) 37.4,15.8 ; 37.4,15.8 v1(38.8,15.8) v1(41.8,15.8) v1(44.8,15.8) v1(47.8,15.8) ; 37.4,15.8 v1(35.8,15.8) ; 7.4,12.8 v1(8.8,12.8) v1(11.8,12.8) v1(14.8,12.8) v1(17.8,12.8) 19.7,12.8 20.4,12.1 v1(22.4,12.1) 24.57,12.1 25.16,11.52 25.64,11.52 26.23,12.1 27.1,12.1 27.68,12.68 29.09,12.68 30.27,11.5 32.83,11.5 35.81,8.52 37.64,8.52 38.23,9.1 v1(40.4,9.1) ; 7.4,12.8 v1(5.8,12.8) 3.4,12.8 v1(3.2,13) ; 7.4,12.8 v1(7.4,15.1)
  Inner2 w0.254: v1(25.4,6.1) 24.77,5.47 22.07,5.47 21.82,5.73 21.82,6.34 23,7.53 23,11.5 v1(22.4,12.1) 22.4,14.27 22.98,14.86 22.98,15.34 22.4,15.93 v1(22.4,18.1) 22.4,20.27 22.98,20.86 22.98,21.34 22.4,21.93 v1(22.4,24.1) ; v1(41.8,15.8) 40.98,14.98 40.98,11.86 40.4,11.27 v1(40.4,9.1) ; v1(37.4,15.1) 37.4,17.27 37.98,17.86 37.98,18.34 37.4,18.93 v1(37.4,21.1) ; v1(7.4,21.1) 7.4,18.93 7.98,18.34 7.98,15.68 v1(7.4,15.1)
CATH_8: length 117.1
  Top Layer w0.254: 10.44,22.43 10.4,22.4 10.4,21.1 ; 40.4,15.1 40.4,16.4 40.44,16.43 ; 10.4,9.1 10.4,10.4 10.44,10.43 ; 41.56,11.57 41.56,12.56 41.8,12.8 ; 2.18,11 3.19,11 ; 32.8,12.8 32.56,12.56 32.56,11.57 ; 25.44,13.43 25.4,13.4 25.4,12.1 ; 23.8,12.8 23.56,12.56 23.56,11.57 ; 20.56,11.57 20.56,12.56 20.8,12.8 ; 38.8,12.8 38.56,12.56 38.56,11.57 ; 47.8,12.8 47.56,12.56 47.56,11.57 ; 35.8,12.8 35.56,12.56 35.56,11.57 ; 29.56,11.57 29.56,12.56 29.8,12.8 ; 40.4,21.1 40.4,22.4 40.44,22.43 ; 26.56,11.57 26.56,12.56 26.8,12.8 ; 25.4,18.1 25.4,19.4 25.44,19.43 ; 25.4,24.1 25.4,25.4 25.44,25.43 ; 10.4,15.1 10.4,16.4 10.44,16.43 ; 44.8,12.8 44.56,12.56 44.56,11.57 ; 28.44,7.43 28.4,7.4 28.4,6.1
  Inner1 w0.254: v1(47.8,12.8) v1(44.8,12.8) v1(41.8,12.8) 40.4,12.8 ; 25.4,12.8 v1(23.8,12.8) v1(20.8,12.8) 18.5,15.1 17.23,15.1 16.64,14.52 13.16,14.52 12.57,15.1 v1(10.4,15.1) ; 25.4,12.8 v1(25.4,12.1) ; 25.4,12.8 v1(26.8,12.8) 27.47,13.47 29.13,13.47 v1(29.8,12.8) v1(32.8,12.8) v1(35.8,12.8) v1(38.8,12.8) 40.4,12.8 ; 40.4,12.8 v1(40.4,15.1) ; v1(10.4,9.1) 8.5,11 v1(3.2,11)
  Inner2 w0.254: v1(40.4,15.1) 40.4,17.27 40.98,17.86 40.98,18.34 40.4,18.93 v1(40.4,21.1) ; v1(28.4,6.1) 29.8,7.5 29.8,8.97 29.22,9.56 29.22,10.04 29.8,10.63 v1(29.8,12.8) ; v1(25.4,12.1) 25.4,14.27 25.98,14.86 25.98,15.34 25.4,15.93 v1(25.4,18.1) 25.4,20.27 24.82,20.86 24.82,21.34 25.4,21.93 v1(25.4,24.1) ; v1(10.4,9.1) 10.4,11.27 9.82,11.86 9.82,12.34 10.4,12.93 v1(10.4,15.1) 9.75,15.75 9.75,20.45 v1(10.4,21.1)
CATH_9: length 122.2
  Top Layer w0.254: 5.8,9.8 5.56,9.56 5.56,8.57 ; 11.56,8.57 11.56,9.56 11.8,9.8 ; 43.4,21.1 43.4,22.4 43.44,22.43 ; 14.8,9.8 14.56,9.56 14.56,8.57 ; 43.44,16.43 43.4,16.4 43.4,15.1 ; 2.18,9 3.19,9 ; 26.8,9.8 26.56,9.56 26.56,8.57 ; 13.4,21.1 13.4,22.4 13.44,22.43 ; 20.56,8.57 20.56,9.56 20.8,9.8 ; 23.8,9.8 23.56,9.56 23.56,8.57 ; 13.44,16.43 13.4,16.4 13.4,15.1 ; 13.44,10.43 13.4,10.4 13.4,9.1 ; 32.8,9.8 32.56,9.56 32.56,8.57 ; 28.4,12.1 28.4,13.4 28.44,13.43 ; 28.4,24.1 28.4,25.4 28.44,25.43 ; LED92.1 8.56,9.56 v1(8.8,9.8) ; 29.8,9.8 29.56,9.56 29.56,8.57 ; 28.44,19.43 28.4,19.4 28.4,18.1 ; 43.44,10.43 43.4,10.4 43.4,9.1 ; 17.8,9.8 17.56,9.56 17.56,8.57
  Inner1 w0.254: v1(28.4,24.1) 27.8,23.5 17.5,23.5 15.1,21.1 v1(13.4,21.1) ; 13.4,9.8 v1(14.8,9.8) 15.95,10.95 16.65,10.95 v1(17.8,9.8) v1(20.8,9.8) v1(23.8,9.8) v1(26.8,9.8) 28.4,9.8 ; 13.4,9.8 v1(13.4,9.1) ; 13.4,9.8 v1(11.8,9.8) 11.8,9.67 10.64,8.52 10.16,8.52 8.87,9.8 v1(8.8,9.8) v1(5.8,9.8) 4,9.8 v1(3.2,9) ; v1(28.4,12.1) 28.4,9.8 ; 28.4,9.8 v1(29.8,9.8) v1(32.8,9.8) 34.6,8 42.3,8 v1(43.4,9.1)
  Inner2 w0.254: v1(13.4,9.1) 13.4,11.27 12.82,11.86 12.82,12.34 13.4,12.93 v1(13.4,15.1) ; v1(43.4,9.1) 43.4,11.27 43.98,11.86 43.98,14.52 v1(43.4,15.1) 43.4,17.27 43.98,17.86 43.98,18.34 43.4,18.93 v1(43.4,21.1) ; v1(28.4,24.1) 28.4,22.43 27.46,21.49 27.46,19.04 v1(28.4,18.1) 27.82,17.52 27.82,14.86 28.4,14.27 v1(28.4,12.1)
CATH_10: length 116.5
  Top Layer w0.254: 31.4,6.1 31.4,7.4 31.44,7.43 ; 16.4,15.1 16.4,16.4 16.44,16.43 ; 31.4,12.1 31.4,13.4 31.44,13.43 ; 44.8,9.8 44.56,9.56 44.56,8.57 ; 46.44,22.43 46.4,22.4 46.4,21.1 ; 31.4,18.1 31.4,19.4 31.44,19.43 ; 16.44,22.43 16.4,22.4 16.4,21.1 ; 47.8,9.8 47.56,9.56 47.56,8.57 ; 41.56,8.57 41.56,9.56 41.8,9.8 ; 46.44,10.43 46.4,10.4 46.4,9.1 ; 31.4,24.1 31.4,25.4 31.44,25.43 ; 16.4,9.1 16.4,10.4 16.44,10.43 ; 38.8,9.8 38.56,9.56 38.56,8.57 ; 35.8,9.8 35.56,9.56 35.56,8.57 ; 46.44,16.43 46.4,16.4 46.4,15.1 ; 2.18,7 3.19,7
  Inner1 w0.254: 46.39,9.8 v1(44.8,9.8) v1(41.8,9.8) v1(38.8,9.8) v1(35.8,9.8) 33.5,12.1 v1(31.4,12.1) ; 46.39,9.8 v1(47.8,9.8) ; 46.39,9.8 46.39,9.11 v1(46.4,9.1) ; v1(3.2,7) 3.2,6.47 4.16,5.52 4.64,5.52 6.13,7 14.3,7 v1(16.4,9.1) 17,8.5 29,8.5 v1(31.4,6.1)
  Inner2 w0.254: v1(16.4,9.1) 16.4,11.27 15.82,11.86 15.82,12.34 16.4,12.93 v1(16.4,15.1) 16.4,17.27 15.82,17.86 15.82,20.52 v1(16.4,21.1) ; v1(31.4,24.1) 31.4,21.93 30.82,21.34 30.82,20.86 31.4,20.27 v1(31.4,18.1) 31.4,15.93 32,15.33 32,14.87 31.4,14.27 v1(31.4,12.1) 31.4,10.1 32,9.5 32,8.87 31.4,8.27 v1(31.4,6.1) ; v1(46.4,21.1) 46.98,20.52 46.98,17.86 46.4,17.27 v1(46.4,15.1) 46.4,12.93 45.82,12.34 45.82,11.86 46.4,11.27 v1(46.4,9.1)
CHRLY_0: length 10.6
  Top Layer w0.254: U1.23 4.1,32.9 3.91,32.71 3.49,32.71 ; 1.37,27 1.3,27.07 v1(1.3,28) TP1.1
  Inner1 w0.254: v1(3.5,32.7) 2.89,33.31 1.81,33.31 1.3,32.8 v1(1.3,28)
CHRLY_1: length 10.1
  Top Layer w0.254: U1.24 4.3,32.5 3.75,31.95 3.5,31.95 ; TP2.1 v1(1.3,26) 1.3,25.07 1.37,25
  Inner1 w0.254: v1(1.3,26) 1.3,27.17 2.1,27.97 2.1,30.05 3.08,31.04 3.08,31.48 v1(3.5,31.9)
CHRLY_2: length 11.7
  Top Layer w0.254: U1.1 4.64,32.05 4.2,31.6 v1(4.2,31.1) ; 1.32,23 1.32,23.98 v1(1.3,24) TP3.1
  Inner1 w0.254: v1(4.2,31.1) 2.5,29.4 2.5,27.87 2,27.37 2,25.87 1.3,25.17 v1(1.3,24)
CHRLY_3: length 13.9
  Top Layer w0.254: 5.4,32.05 5.4,31.75 5.22,31.57 4.93,31.57 4.9,31.55 v1(4.9,30.8) ; TP4.1 v1(1.3,22) 1.32,21.98 1.32,21
  Inner1 w0.254: v1(4.9,30.8) 3,28.9 3,27.58 2.5,27.08 2.5,25.58 1.88,24.96 1.88,23.76 1.3,23.17 v1(1.3,22)
CHRLY_4: length 15.9
  Top Layer w0.254: v1(5.6,31.1) 5.8,31.3 U1.3 ; TP5.1 v1(1.3,20) 1.3,19.02 1.32,19
  Inner1 w0.254: v1(5.6,31.1) 5.6,30.6 3.83,28.83 3.83,26.41 2.25,24.83 2.25,23.62 2,23.37 2,20.7 v1(1.3,20)
CHRLY_5: length 18.1
  Top Layer w0.254: U1.4 6.2,30.9 v1(6.3,30.8) ; TP6.1 v1(1.3,18) 1.3,17.02 1.32,17
  Inner1 w0.254: v1(6.3,30.8) 6.3,30.8 4.19,28.69 4.19,25.06 2.5,23.37 2.5,20 1.3,18.8 v1(1.3,18)
CHRLY_6: length 20.9
  Top Layer w0.254: TP7.1 v1(1.3,16) 1.3,15.02 1.32,15 ; U1.5 6.6,31.5 v1(7,31.1)
  Inner1 w0.254: v1(1.3,16) 1.3,17 1.88,17.58 1.88,18.86 3.82,20.79 3.82,22.69 4.98,23.86 4.98,24.52 4.55,24.95 4.55,28.22 7,30.67 v1(7,31.1)
CHRLY_7: length 26.4
  Top Layer w0.254: U1.6 7,31.8 7.1,31.7 7.52,31.7 7.7,31.52 v1(7.7,30.8) ; 1.32,13 1.3,13.02 v1(1.3,14) TP8.1
  Inner2 w0.254: v1(7.7,30.8) 6.9,30 2.47,30 0.5,28.03 0.5,14.8 v1(1.3,14)
CHRLY_8: length 28.5
  Top Layer w0.254: U1.7 7.7,32.5 8.25,31.95 8.5,31.95 ; TP9.1 v1(1.3,12) 1.3,11.02 1.32,11
  Inner2 w0.254: v1(1.3,12) 1.88,12.58 1.88,27.88 3,29 7,29 8.5,30.5 v1(8.5,31.9)
CHRLY_9: length 30.7
  Top Layer w0.254: TP10.1 v1(1.3,10) 1.3,9.02 1.32,9 ; 8.51,32.71 8.09,32.71 7.9,32.9 U1.8
  Inner1 w0.254: v1(1.3,10) 1.88,10.58 1.88,16.86 5,19.97 5,23 6.5,24.5 6.5,25 5,26.5 5,27.83 7.39,30.22 7.94,30.22 8.28,30.56 8.28,31.04 7.92,31.41 7.92,32.14 8.47,32.7 v1(8.5,32.7)
CHRLY_10: length 35.6
  Top Layer w0.254: TP11.1 v1(1.3,8) 1.3,7.02 1.32,7 ; U1.9 9,33.3 v1(9.2,33.1)
  Inner2 w0.254: v1(1.3,8) 2.5,9.2 2.5,27.5 3.5,28.5 8,28.5 10.08,30.58 10.08,32.22 v1(9.2,33.1)
FPGA_EN: length 22.9
  Top Layer w0.254: U1.10 10.05,33.7 10.5,33.25 R53.2 10.57,32.5 v1(11.5,32.5) ; U2.12 26.47,30.5 v1(26.81,30.16)
  Inner2 w0.254: v1(26.81,30.16) 23.04,30.16 22.69,29.82 22.21,29.82 21.86,30.16 13.84,30.16 v1(11.5,32.5)
FPGA_RST: length 21.6
  Top Layer w0.254: U2.8 23.5,30.7 23.2,30.4 v1(22.45,30.4) ; v1(11.5,34.5) 10.57,34.5 R54.2 10.03,34.1 U1.11
  Inner1 w0.254: 22.36,30.4 11.9,30.4 10.53,31.78 10.53,33.53 v1(11.5,34.5)
SPI_CS: length 31.5
  Top Layer w0.254: v1(12.6,33) 12.6,31.23 U3.1 12.59,29.03 R55.2 ; v1(23.55,34.2) 23.57,34.18 24.6,34.18 24.75,34.03 U2.3 ; v1(5,35.9) 5.4,35.5 U1.17
  Inner1 w0.254: v1(12.6,33) 12.6,34.4 11.92,35.08 11.08,35.08 10.5,34.5 6.4,34.5 v1(5,35.9)
  Inner2 w0.254: v1(23.55,34.2) 22.7,34.2 21.29,32.79 21.29,31.31 20.98,31 17,31 14.42,33.58 13.18,33.58 v1(12.6,33)
SPI_MISO: length 30.1
  Top Layer w0.254: v1(13.87,33) 13.87,31.23 U3.2 ; U1.18 5,35.2 4.9,35.3 4.48,35.3 4.3,35.48 v1(4.3,36.2) ; v1(22.45,32.8) 22.5,32.75 U2.5
  Inner1 w0.254: v1(4.3,36.2) 4.3,36.7 5.1,37.5 13,37.5 13.87,36.63 v1(13.87,33)
  Inner2 w0.254: v1(22.45,32.8) 22.44,32.81 21.65,32.02 21.65,31.16 21,30.52 16.35,30.52 v1(13.87,33)
SPI_MOSI: length 31.9
  Top Layer w0.254: v1(16.4,35) 16.41,35 U3.5 ; U2.2 25.25,34.03 25.4,34.18 26.43,34.18 v1(26.45,34.2) ; U1.19 4.3,34.5 3.75,35.05 3.5,35.05
  Inner1 w0.254: v1(26.45,34.2) 25.07,35.58 21.86,35.58 21.27,35 v1(16.4,35) 13.4,38 5,38 3.5,36.5 v1(3.5,35.1)
SPI_SCK: length 32.7
  Top Layer w0.254: v1(5.7,36.2) 5.8,36.1 U1.16 ; U3.6 15.13,35 v1(15.13,35) ; v1(22.45,32) 22.48,32 22.72,32.25 U2.6
  Inner1 w0.254: v1(5.7,36.2) 5.7,36.24 6.46,37 7.16,37 7.58,36.58 8.84,36.58 9.26,37 10.21,37 10.62,36.59 11.89,36.59 12.14,36.84 12.66,36.84 13.26,36.24 13.26,32.61 13.45,32.42 14.23,32.42 14.48,32.67 14.48,34.35 v1(15.13,35) 16.09,34.04 16.35,34.04 16.96,34.64 17.21,34.64 18.03,33.82 18.03,33.57 17.43,32.96 17.43,32.7 18.48,31.65 18.84,31.65 20.63,33.43 20.99,33.43 22.42,32 v1(22.45,32)
USB_D+: length 30.9
  Top Layer w0.254: C1.6 41.25,31.65 v1(41.1,31.5) 40.4,31.5 40.25,31.65 C1.8 40.25,33.35 38.8,34.8 35.1,34.8 34.68,34.38 R24.2 ; U2.14 26.97,31.75 27.52,31.2 v1(27.55,31.2)
  Inner1 w0.254: v1(41.1,31.5) 41.1,32.5 38.7,34.9 36.3,34.9 34.6,33.2 29.91,33.2 27.91,31.2 v1(27.55,31.2)
USB_D-: length 19.7
  Top Layer w0.254: C1.7 40.75,33.65 v1(40.9,33.8) 41.6,33.8 41.75,33.65 C1.5 ; v1(27.55,32) 27.52,32 27.28,32.25 U2.15
  Inner1 w0.254: v1(40.9,33.8) 39.4,35.3 36.1,35.3 34.46,33.66 29.76,33.66 28.1,32 v1(27.55,32)
$1N623: length 3.7
  Top Layer w0.254: R18.1 39.25,29.18 C1.10
$1N632: length 3.7
  Top Layer w0.254: C1.4 42.25,29.18 R19.1
$1N2896: length 1.7
  Top Layer w0.254: BOOT.1 33.18,32.64 R24.1
$1N3149: length 32.7
  Top Layer w0.254: RST.1 46.68,32.53 C6.1 47.32,31.89 R23.1 v1(46.25,29) ; v1(22.45,31.2) 22.48,31.2 23.03,31.75 U2.7
  Inner1 w0.254: v1(22.45,31.2) 22.5,31.2 25.32,28.38 28.11,28.38 29.31,29.58 45.67,29.58 v1(46.25,29)
$1N19196: length 3.6
  Top Layer w0.254: R57.2 15.57,38.57 15.18,38.18 14.04,38.18 13.87,38 U3.7
$1N19224: length 2.4
  Top Layer w0.254: U3.3 15.13,29.43 R56.2
$1N40380: length 8.9
  Top Layer w0.254: v1(27,29) 25.8,29 LED106.1 ; U2.4 v1(23.05,33.5)
  Inner1 w0.254: v1(23.05,33.5) 23.05,32.35 26.4,29 v1(27,29)
$1N40391: length 3.3
  Top Layer w0.254: LED106.2 20.94,29 R52.1

## Copper pours and planes (outline as drawn; the poured copper is in the pictures)
+3V3 on Top Layer: 25.01,35.9 29.56,35.9 29.56,32.4 25.01,32.4
+3V3 on Inner2: 25.01,35.9 29.56,35.9 29.56,32.4 25.01,32.4
+3V3 on Inner2: 1,38 29.5,38 29.5,32 25,32 25,34.5 22.5,34.5 22.5,28.5 10.5,28.5 10.5,34 1,34
GND on Top Layer: 1.5,39.25 10.5,39.25 10.5,36.75 1.5,36.75
GND on Top Layer: 0,40 50,40 50,0 0,0
GND on Bottom Layer: 0,40 50,40 50,0 0,0
GND on Inner1: 0,40 50,40 50,0 0,0
GND on Inner2: 0,40 50,40 50,0 0,0

Small or netless copper shapes (teardrops, artwork), in the pictures only: 170 on Top Layer, 8 on Bottom Layer, 28 on Inner1, 27 on Inner2

## Text on the board
Bottom Silkscreen Layer: Annoyedmilk
Top Solder Mask Layer: SLG47910V
